# EasyEDA schematic SCH_abi_2024-02-13.json
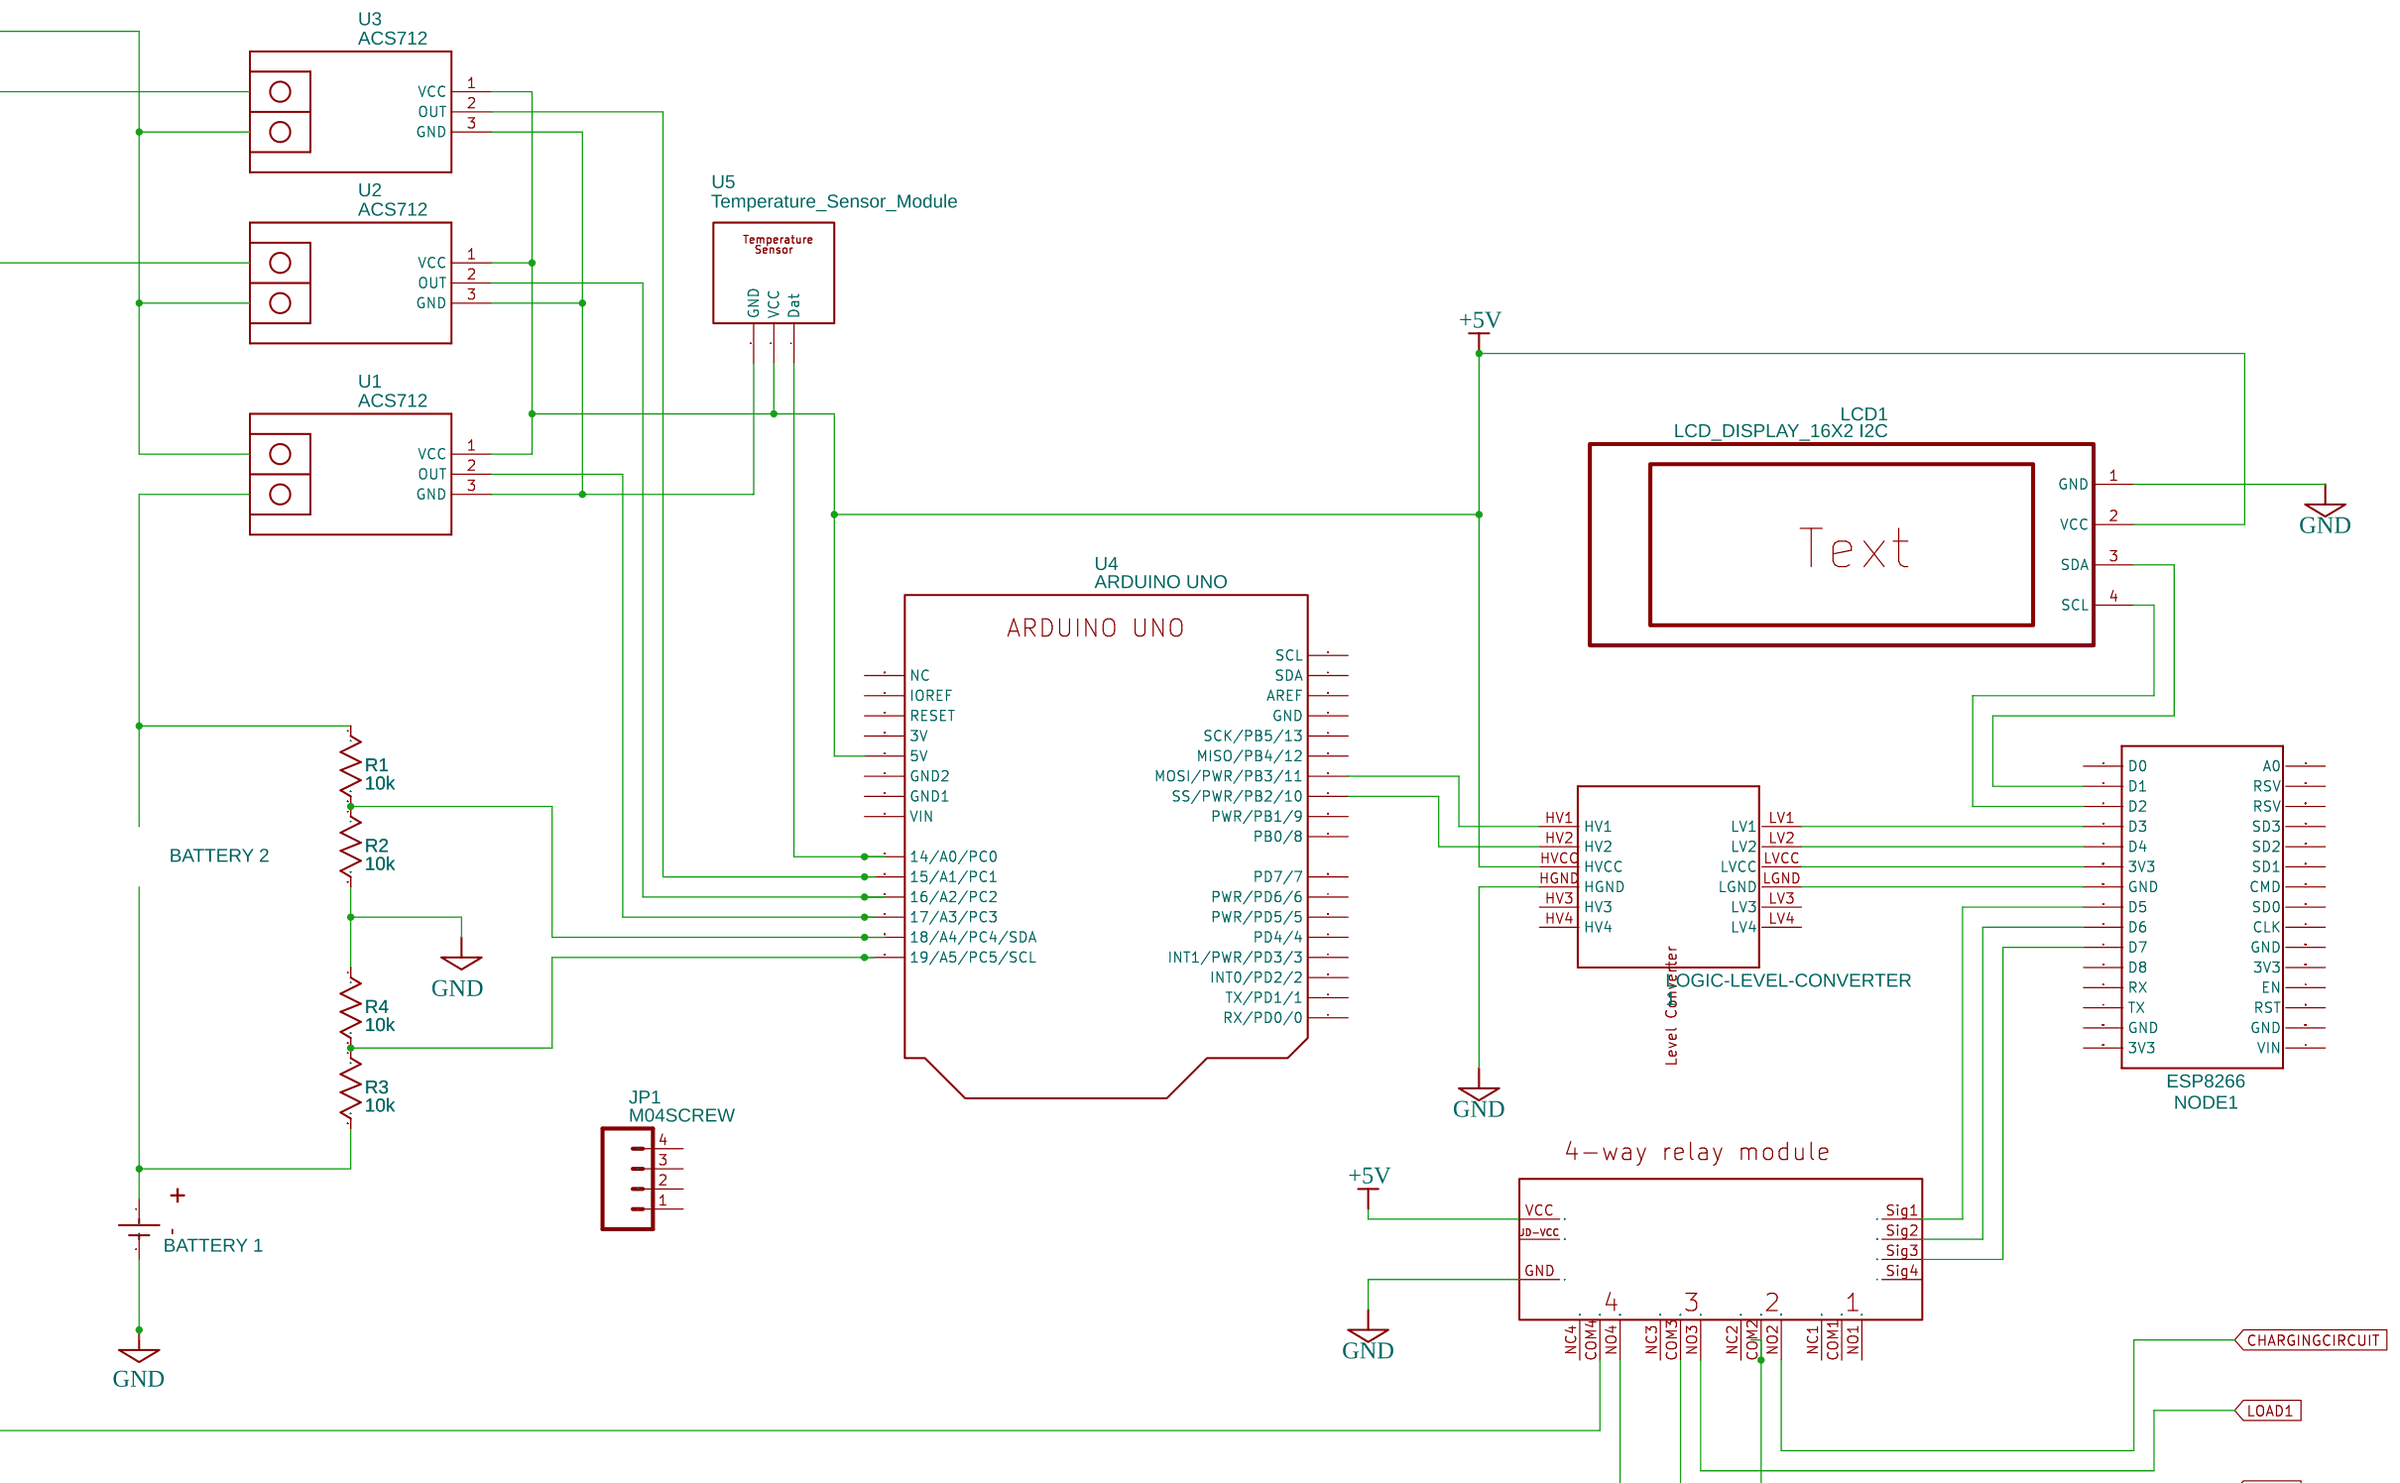
[diagram p0: schematic sheet]

## Parts
1  LOGIC-LEVEL-CONVERTER  [LOGIC-LEVEL-CONVERTER]
G2  BATTERY 1  [&#126;]
JP1  M04SCREW  [SCREWTERMINAL-3.5MM-4]
LCD1  LCD_DISPLAY_16X2 I2C  [LCD_2004_4-8BIT_IF LCD_2004_4-8BIT_IF V4 I2C]
NODE1  ESP8266  [NODEMCU_ESP8266_NODEMCU_ESP8266]
R1  10k  [R0603]
R2  10k  [R0603]
R3  10k  [R0603]
R4  10k  [R0603]
U1  ACS712  [CURRENT-SENSOR-ACS712]
U2  ACS712  [CURRENT-SENSOR-ACS712]
U3  ACS712  [CURRENT-SENSOR-ACS712]
U4  ARDUINO UNO  [UNO_R3;WO ARDUINO UNO]
U5  Temperature_Sensor_Module  [DS18B20_TEMPERATURE_SENSOR_MODULE_KIT]
U6  4 way relay

## Library data of the parts
1 = LOGIC-LEVEL-CONVERTER: Contributor: LukasH97
G2 = BATTERY-1ELEMENT_RevE_Date15jun2010: Contributor: KiCAD; license: https://www.gnu.org/licenses/lgpl-2.1.html
JP1 = M04SCREW: Header 4; Contributor: SparkFun
LCD1 = LCD_DISPLAY_16X2 I2C: 15: A; sourceId: yDLFXRL3l; Contributor: sietsestiksma
NODE1 = ESP8266 COPY: Contributor: nikolai0
R1-R4 = R_0603_US: Contributor: LCEDA_Lib
U1-U3 = CURRENT-SENSOR-ACS712: Isolated Bipolar Current Sensors based on ACS712 chip
U4 = ARDUINO UNO: Contributor: sophiachen04; sourceId: frlCUcuMG
U5 = DS18B20_Temperature_Sensor_Module: Contributor: coveyjorjet13
U6 = 4 way relay: Contributor: doganmehmetemre20

## Nets
+5V: 1.HVCC LCD1.2(VCC) U1.1(VCC) U2.1(VCC) U3.1(VCC) U4.28(5V) U5.2(VCC) U6.VCC(6)
GND: 1.HGND G2.2(Minus) LCD1.1(GND) R2.2 R4.1 U6.GND(5)
CHARGINGCIRCUIT: U6.NO2(8)
LOAD1: U6.NO3(8)
LOAD2: U6.NO4(8)
Net-(1-HV1): 1.HV1 U4.12(MOSI/PWR/PB3/11)
Net-(1-HV2): 1.HV2 U4.11(SS/PWR/PB2/10)
Net-(1-LGND): 1.LGND NODE1.GND@2(GND)
Net-(1-LV1): 1.LV1 NODE1.D3
Net-(1-LV2): 1.LV2 NODE1.D4
Net-(1-LVCC): 1.LVCC NODE1.3V3@2(3V3)
Net-(G2-1): G2.1(Plus) R3.2
Net-(LCD1-3): LCD1.3(SDA) NODE1.D1
Net-(LCD1-4): LCD1.4(SCL) NODE1.D2
Net-(NODE1-D5): NODE1.D5 U6.Sig1(1)
Net-(NODE1-D6): NODE1.D6 U6.Sig2(2)
Net-(NODE1-D7): NODE1.D7 U6.Sig3(3)
Net-(R1-2): R1.2 R2.1 U4.20(18/A4/PC4/SDA)
Net-(R3-1): R3.1 R4.2 U4.19(19/A5/PC5/SCL)
Net-(U1-2): U1.2(OUT) U4.21(17/A3/PC3)
Net-(U1-3): U1.3(GND) U2.3(GND) U3.3(GND) U5.3(GND)
Net-(U2-2): U2.2(OUT) U4.22(16/A2/PC2)
Net-(U3-2): U3.2(OUT) U4.23(15/A1/PC1)
Net-(U4-24): U4.24(14/A0/PC0) U5.1(Dat)

Not connected (* = marked no-connect by the designer): 1 HV3 HV4 LV3 LV4; JP1 1 2 3 4; NODE1 3V3@1(3V3) 3V3@3(3V3) A0 CLK CMD D0 D8 EN GND@1(GND) GND@3(GND) GND@4(GND) RST RSV1(RSV) RSV2(RSV) RX SD1 SD2 SD3 SDO(SD0) TX VIN; R1 1; U4 1(RX/PD0/0) 2(TX/PD1/1) 3(INT0/PD2/2) 4(INT1/PWR/PD3/3) 5(PD4/4) 6(PWR/PD5/5) 7(PWR/PD6/6) 8(PD7/7) 9(PB0/8) 10(PWR/PB1/9) 13(MISO/PB4/12) 14(SCK/PB5/13) 15(GND) 16(AREF) 17(SDA) 18(SCL) 25(VIN) 26(GND1) 27(GND2) 29(3V) 30(RESET) 31(IOREF) 32(NC); U6 COM1(8) COM2(8) COM3(8) COM4(8) JD-VCC(6) NC1(8) NC2(8) NC3(8) NC4(8) NO1(8) Sig4(4)

## Notes on the sheet
- BATTERY 2
